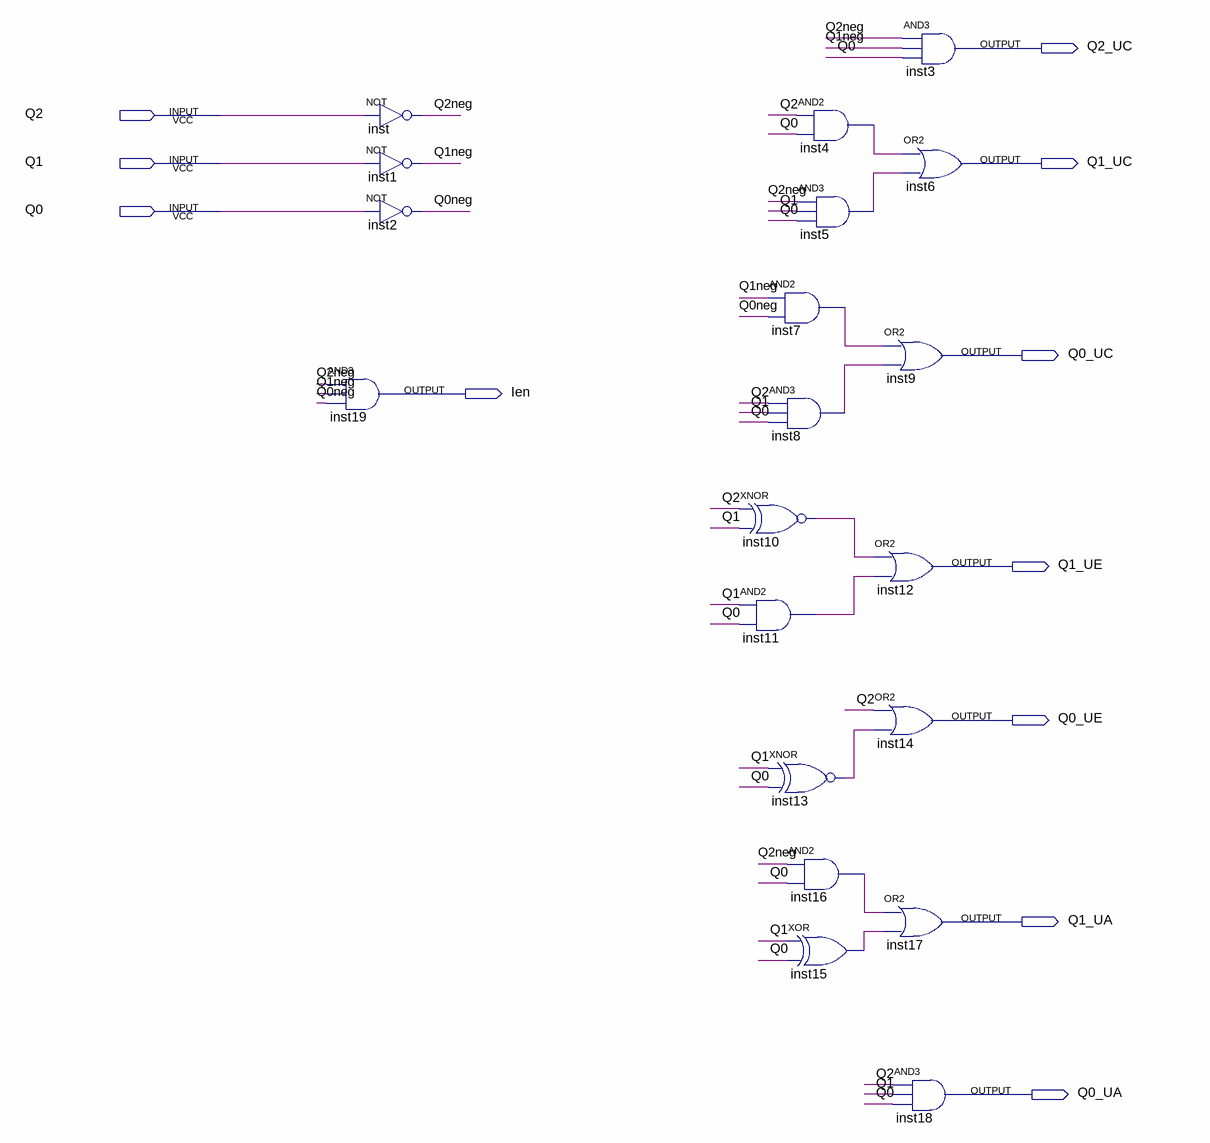
[diagram p0: schematic sheet]
// Quartus schematic decodificador_salida.bdf as structural Verilog: 20 symbols, 11 pins
module decodificador_salida (
  input  Q2,
  input  Q1,
  input  Q0,
  output Q2_UC,
  output Q1_UC,
  output Q0_UC,
  output Ien,
  output Q1_UE,
  output Q0_UE,
  output Q1_UA,
  output Q0_UA
);

  wire inst4_out, inst5_out, inst7_out, inst8_out, inst10_out, inst11_out, inst13_out, inst15_out,
       inst16_out, Q0neg, Q1neg, Q2neg;

  and inst19 (Ien, Q2neg, Q1neg, Q0neg);
  not inst (Q2neg, Q2);
  not inst1 (Q1neg, Q1);
  not inst2 (Q0neg, Q0);
  and inst4 (inst4_out, Q2, Q0);
  and inst5 (inst5_out, Q2neg, Q1, Q0);
  and inst7 (inst7_out, Q1neg, Q0neg);
  and inst8 (inst8_out, Q2, Q1, Q0);
  xnor inst10 (inst10_out, Q2, Q1);
  and inst11 (inst11_out, Q1, Q0);
  xnor inst13 (inst13_out, Q1, Q0);
  and inst16 (inst16_out, Q2neg, Q0);
  xor inst15 (inst15_out, Q1, Q0);
  or inst12 (Q1_UE, inst10_out, inst11_out);
  or inst14 (Q0_UE, Q2, inst13_out);
  and inst3 (Q2_UC, Q2neg, Q1neg, Q0);
  or inst6 (Q1_UC, inst4_out, inst5_out);
  or inst9 (Q0_UC, inst7_out, inst8_out);
  or inst17 (Q1_UA, inst16_out, inst15_out);
  and inst18 (Q0_UA, Q2, Q1, Q0);
endmodule
